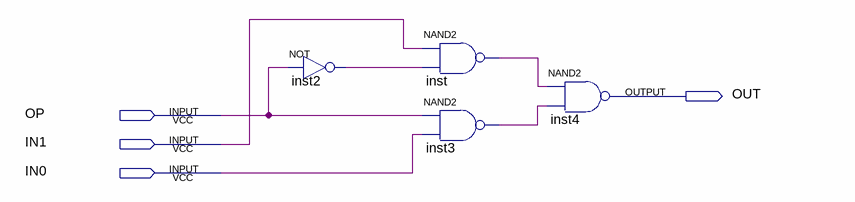
[diagram p0: schematic sheet]
// Quartus schematic 2x1mux.bdf as structural Verilog: 4 symbols, 4 pins
module \2x1mux  (
  input  OP,
  input  IN1,
  input  IN0,
  output OUT
);

  wire inst2_out, inst3_out, inst_out;

  not inst2 (inst2_out, OP);
  nand inst (inst_out, IN1, inst2_out);
  nand inst3 (inst3_out, OP, IN0);
  nand inst4 (OUT, inst_out, inst3_out);
endmodule
